# EAGLE schematic tx_no_transistor (EAGLE 9.6.1)
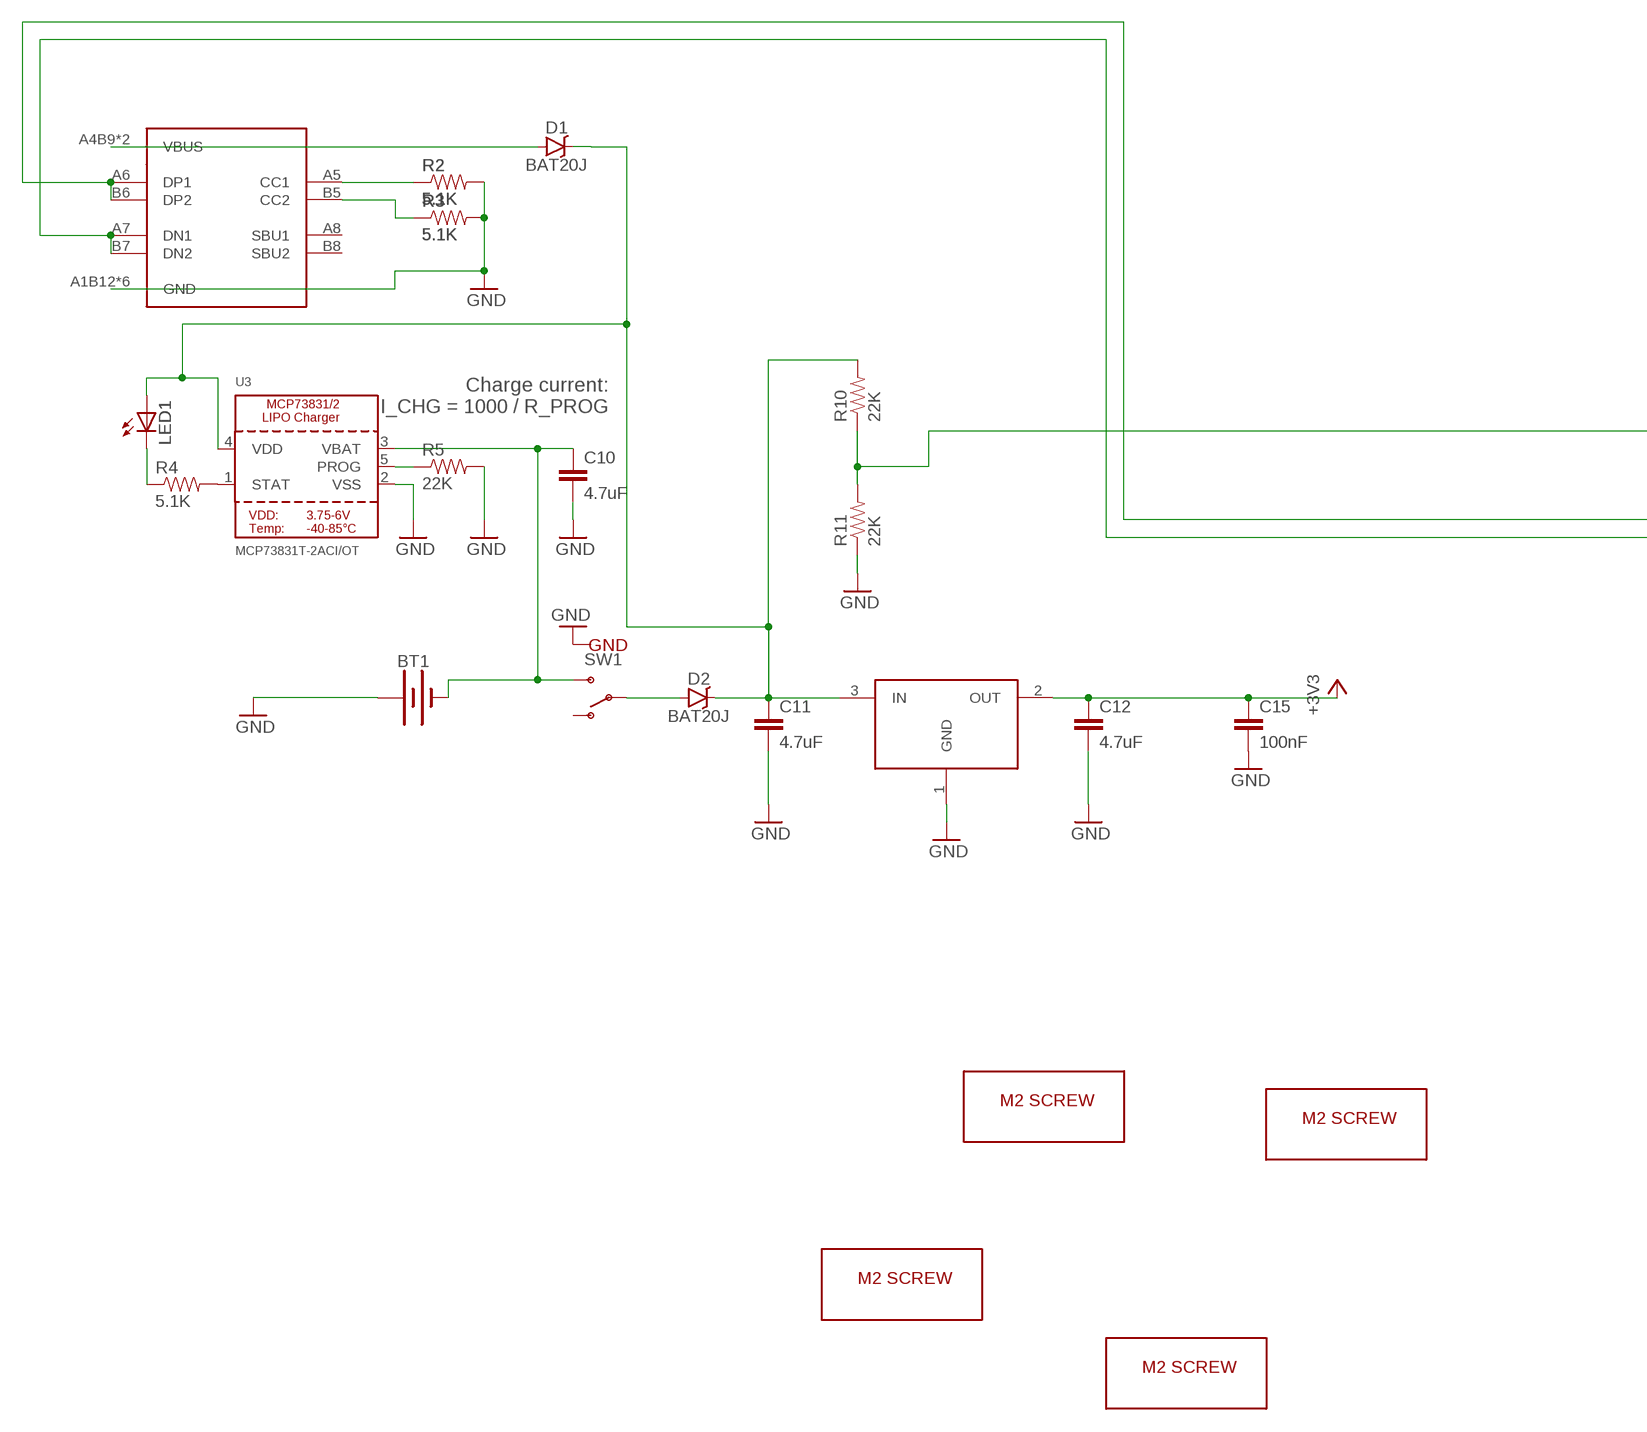
[diagram p0: schematic, sheet 1, part 1 of 2]
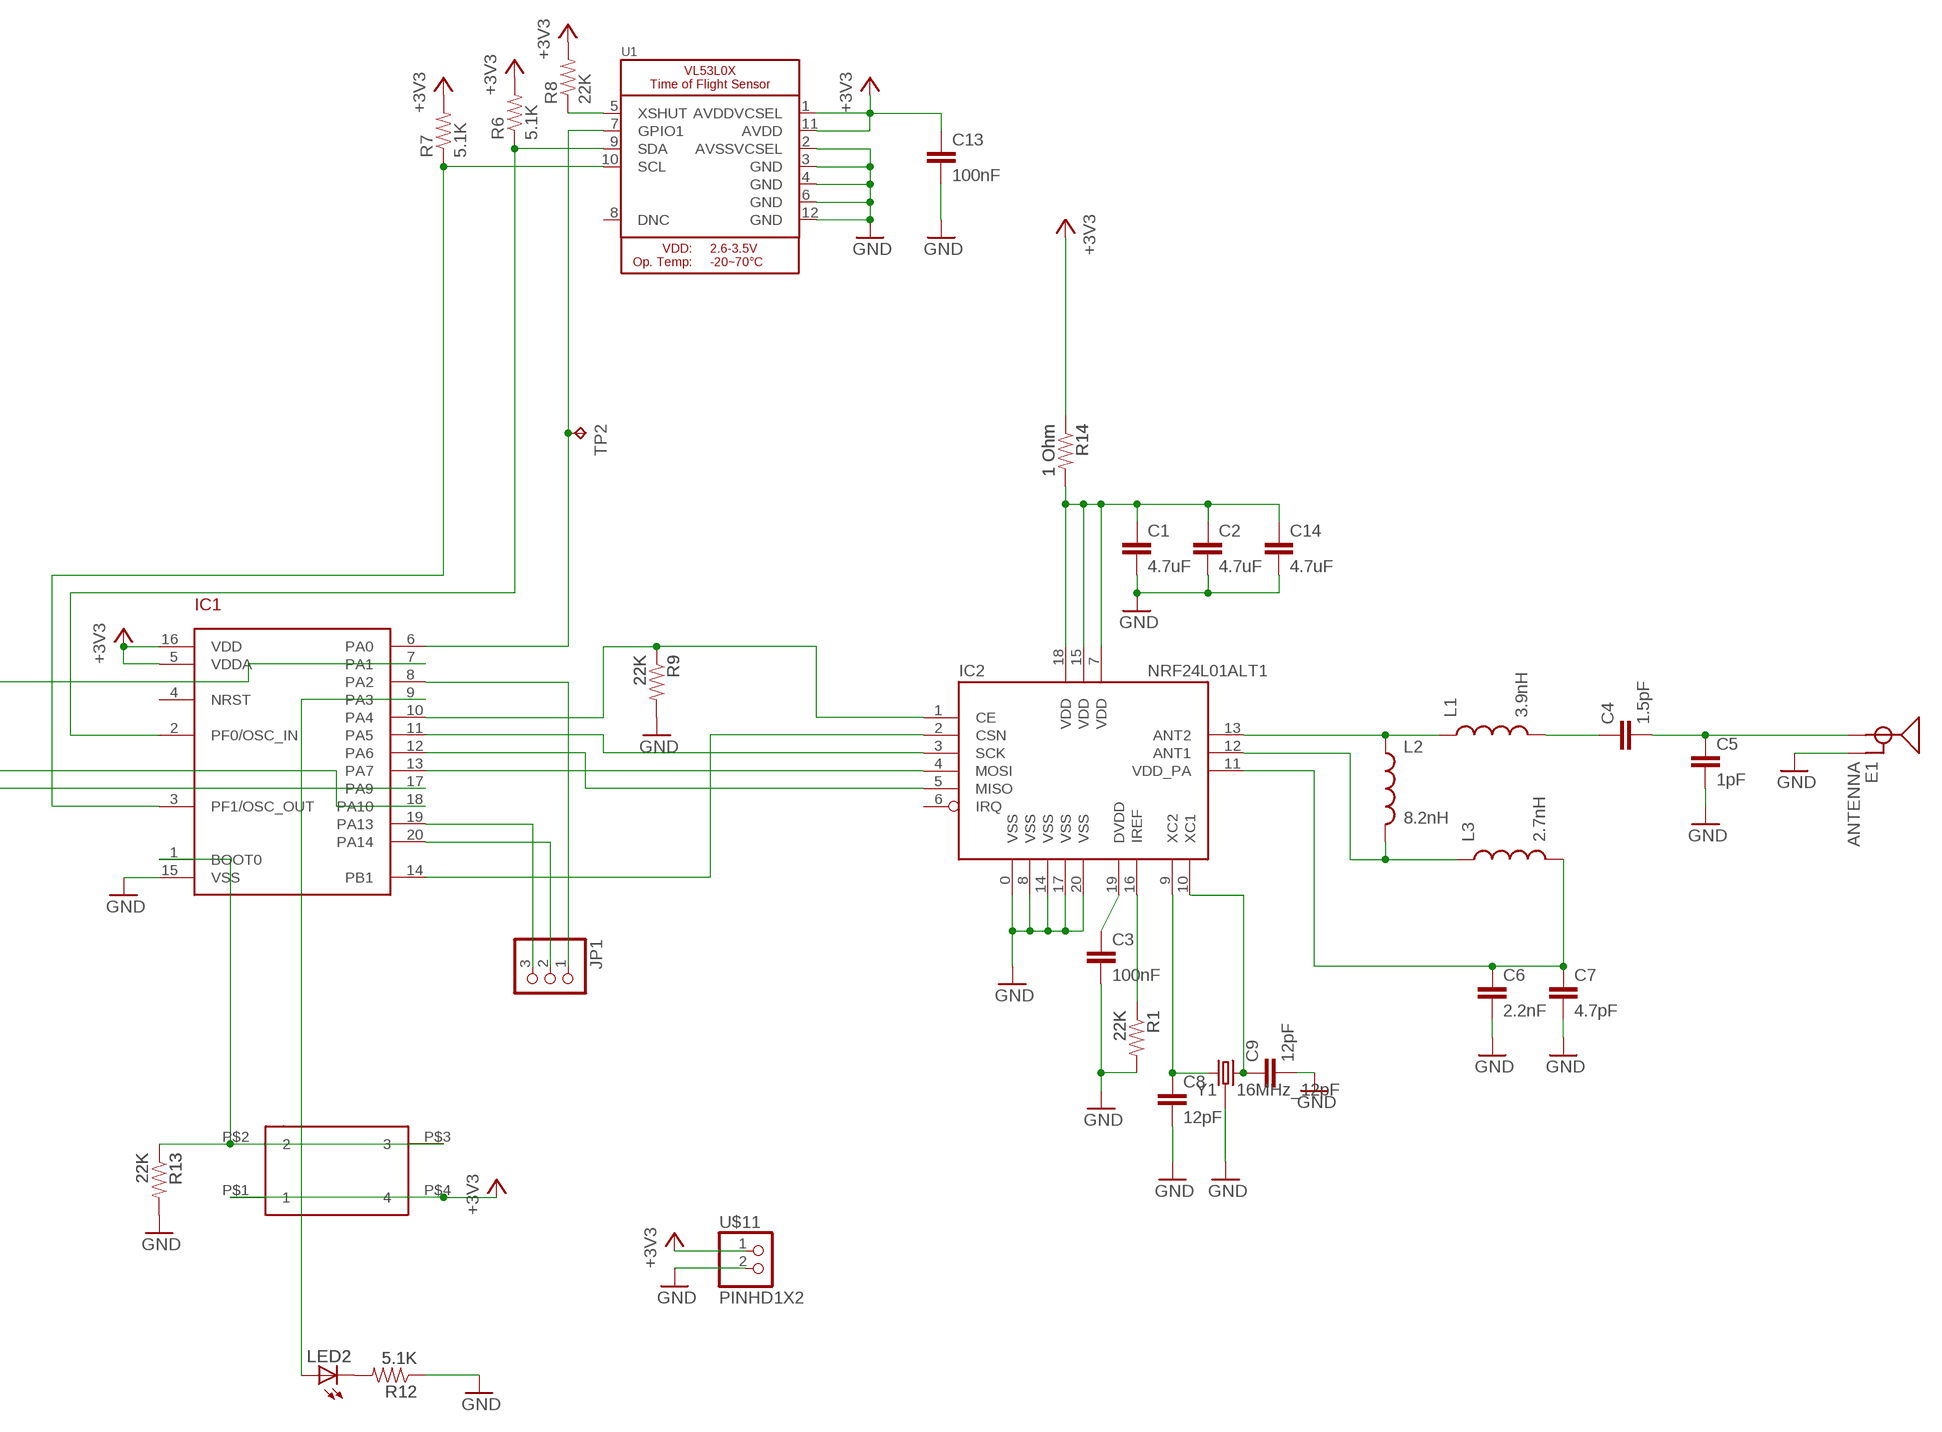
[diagram p1: schematic, sheet 1, part 2 of 2]

## Parts
BT1  TX_SPARKFUN-BATTERIES_BATTERY-24.5MM_PTH  [TX_SPARKFUN-BATTERIES_BATTCON_24.5MM_PTH]
C1  4.7uF  CAP0805  [0805]
C2  4.7uF  CAP0805  [0805]
C3  100nF  CAP0805  [0805]
C4  1.5pF  CAP0805  [0805]
C5  1pF  CAP0805  [0805]
C6  2.2nF  CAP0805  [0805]
C7  4.7pF  CAP0805  [0805]
C8  12pF  CAP0805  [0805]
C9  12pF  CAP0805  [0805]
C10  4.7uF  CAP0805  [0805]
C11  4.7uF  CAP0805  [0805]
C12  4.7uF  CAP0805  [0805]
C13  100nF  CAP0805  [0805]
C14  4.7uF  CAP0805  [0805]
C15  100nF  CAP0805  [0805]
D1  BAT20J  DIODE-SCHOTTKY-BAT20J  [SOD-323]
D2  BAT20J  DIODE-SCHOTTKY-BAT20J  [SOD-323]
E1  ANTENNA  ANTENNATRACE-TUNED  [TRACE_ANTENNA_2.4GHZ_25.7MM_TUNED]
IC1  STM32F030F4  [TSSOP20]
IC2  NRF24L01ALT1  [QFN20_ALT1]
JP1  PINHD-1X3CB  [1X03-CLEANBIG]
L1  3.9nH  INDUCTOR0805  [0805]
L2  8.2nH  INDUCTOR0805  [0805]
L3  2.7nH  INDUCTOR0805  [0805]
LED1  LEDCHIP-LED0805  [CHIP-LED0805]
LED2  LEDCHIP-LED0805  [CHIP-LED0805]
R1  22K  RESISTOR0805-RES  [0805]
R2  5.1K  RESISTOR0805-RES  [0805]
R3  5.1K  RESISTOR0805-RES  [0805]
R4  5.1K  RESISTOR0805-RES  [0805]
R5  22K  RESISTOR0805-RES  [0805]
R6  5.1K  RESISTOR0805-RES  [0805]
R7  5.1K  RESISTOR0805-RES  [0805]
R8  22K  RESISTOR0805-RES  [0805]
R9  22K  RESISTOR0805-RES  [0805]
R10  22K  RESISTOR0805-RES  [0805]
R11  22K  RESISTOR0805-RES  [0805]
R12  5.1K  RESISTOR0805-RES  [0805]
R13  22K  RESISTOR0805-RES  [0805]
R14  1 Ohm  RESISTOR0805-RES  [0805]
SW1  SWITCH-SPDTTDFGDFG  [SWITCH-SPST-SMD-A]
SW2  324_SW324_SWITCH_FOOT_HOLE  [342_SWICH_FOOT_HOLE]
TP2  TPTP10R  [TP10R]
U1  VL53L0X  [LGA12_ST]
U2  USBC_16P  [USBC_16P_FOOT]
U3  MCP73831T-2ACI/OT  MCP73831/2  [SOT23-5]
U4  XC6206_DEV  [SOT23R_INFINEON]
U$1  M2_SCREW_DEV  [M2_SCREW_FOOT]
U$11  PINHD1X2  [1X02]
U$12  M2_SCREW_DEV  [M2_SCREW_FOOT]
U$13  M2_SCREW_DEV  [M2_SCREW_FOOT]
U$14  M2_SCREW_DEV  [M2_SCREW_FOOT]
Y1  16MHz_12pF  CRYSTAL-26MHZSMD-3.2X2.5  [CRYSTAL-SMD-3.2X2.5MM]

## Nets
+3V3: C12.1 C13.1 C15.1 IC1.5(VDDA) IC1.16(VDD) R6.2 R7.2 R8.2 R14.1 SW2.P$1 SW2.P$4 U1.1(AVDDVCSEL) U1.11(AVDD) U4.2(OUT) U$11.1
GND: BT1.2(+) C1.2 C2.2 C3.2 C5.2 C6.2 C7.2 C8.2 C9.2 C10.2 C11.2 C12.2 C13.2 C14.2 C15.2 E1.GND E1.GND2(GND) IC1.15(VSS) IC2.0(VSS) IC2.8(VSS) IC2.14(VSS) IC2.17(VSS) IC2.20(VSS) R1.2 R2.2 R3.2 R5.2 R9.2 R11.1 R12.1 R13.2 SW1.G1(GND) SW1.G2(GND) SW1.G3(GND) SW1.G4(GND) U1.2(AVSSVCSEL) U1.3(GND) U1.4(GND) U1.6(GND) U1.12(GND) U2.A1B12(GND) U2.B11A12(GND) U2.P$13(GND) U2.P$14(GND) U2.P$15(GND) U2.P$16(GND) U3.2(VSS) U4.1(GND) U$11.2 Y1.2 Y1.4
N$1: C3.1 IC2.19(DVDD)
N$2: IC2.16(IREF) R1.1
N$3: IC2.13(ANT2) L1.1 L2.1
N$4: C4.1 L1.2
N$5: C4.2 C5.1 E1.ANT(SIGNAL)
N$6: IC2.12(ANT1) L2.2 L3.1
N$7: C8.1 IC2.9(XC2) Y1.1
N$8: C6.1 C7.1 IC2.11(VDD_PA) L3.2
N$9: C9.1 IC2.10(XC1) Y1.3
N$10: R3.1 U2.B5(CC2)
N$11: R2.1 U2.A5(CC1)
N$12: LED1.C R4.1
N$13: R4.2 U3.1(STAT)
N$14: IC1.13(PA7) IC2.4(MOSI)
N$15: IC1.12(PA6) IC2.5(MISO)
N$16: IC1.11(PA5) IC2.3(SCK)
N$17: R5.1 U3.5(PROG)
N$18: IC1.18(PA10) U2.A6(DP1) U2.B6(DP2)
N$19: D2.A SW1.2(P)
N$20: IC1.14(PB1) IC2.2(CSN)
N$21: IC1.10(PA4) IC2.1(CE) R9.1
N$22: IC1.3(PF1/OSC_OUT) R7.1 U1.10(SCL)
N$23: IC1.2(PF0/OSC_IN) R6.1 U1.9(SDA)
N$24: R8.1 U1.5(XSHUT)
N$25: BT1.1(-) C10.1 SW1.3(S) U3.3(VBAT)
N$26: D1.A U2.A4B9(VBUS) U2.B4A9(VBUS)
N$27: C11.1 D1.C D2.C LED1.A R10.2 U3.4(VDD) U4.3(IN)
N$28: LED2.C R12.2
N$29: IC1.9(PA3) LED2.A
N$30: IC1.1(BOOT0) R13.1 SW2.P$2 SW2.P$3
N$31: IC1.19(PA13) JP1.3
N$32: IC1.20(PA14) JP1.2
N$33: IC1.8(PA2) JP1.1
N$34: IC1.17(PA9) U2.A7(DN1) U2.B7(DN2)
N$35: IC1.7(PA1) R10.1 R11.2
N$36: IC1.6(PA0) TP2.TP U1.7(GPIO1)
N$37: C1.1 C2.1 C14.1 IC2.7(VDD) IC2.15(VDD) IC2.18(VDD) R14.2
Unconnected: IC1.4(NRST) IC2.6(IRQ) SW1.1(O) U1.8(DNC) U2.A8(SBU1) U2.B8(SBU2)

## Notes on the sheet
- Charge current:
  I_CHG = 1000 / R_PROG

## Library data of the parts
BT1 = tx:TX_SPARKFUN-BATTERIES_BATTERY: Battery - Single Cell A variety of battery chemistries, sizes, and footprints. Device List: 20MM_PTH - Coin Cell Battery Holder - 20mm (PTH) <https://www.sparkfun.com/products/783> 20MM_PTH_KIT- Coin Cell battery Holder - 20 mm (PTH) <http://www.sparkfun.com/products/783>kit version with special mask 6.8MM_PTH - Coin Cell Battery Holder - 6.8MM(SMD) <https://www.digikey.com/product-detail/en/seiko-instruments/MS621FE-FL11E/728-1057-ND/1889208?WT.srch=1&gclid=CNOQ5a6LzdQCFZS2wAodXCkE0g> 12MM_SMD - Coin Cell Battery Holder - 12mm (SMD) <https://www.sparkfun.com/products/10592> 12MM_PTH - Coin Cell Battery Holder - 12mm (PTH) <https://www.sparkfun.com/products/7948> 20MM_SMD - 20mm Coin Cell Battery Holder (SMD) (2 legs) Used on the Big Time Watch Kit <https://www.sparkfun.com/products/11734> 20MM_SMD_4LEGS - Coin Cell Battery Holder - 20mm (SMD) <https://www.sparkfun.com/products/11892> 20MM_SMD_4LEGS_OVERPASTE - Coin Cell Battery Holder - 20mm (SMD) <https://www.sparkfun.com/products/11892> (Over-paste on the legs) 24.5MM_PTH - Coin Cell Battery Holder - 24.5mm (PTH) <https://www.sparkfun.com/products/8863> 9V - 9V Battery Holder - PC Mount Used on the SparkFun SparkPunk Sound Kit <https://www.sparkfun.com/products/11177> and SparkFun SparkPunk Sequencer Kit <https://www.sparkfun.com/products/12707> 18650 - Battery Holder - 18650 (PTH) <https://www.sparkfun.com/products/13113> AA - Battery Holder - 1xAA (PTH) <https://www.sparkfun.com/products/7949> AAA - Battery Holder - 1xAAA (PTH) <https://www.sparkfun.com/products/12718> AA_KIT - Battery Holder - 1xAA (PTH) <https://www.sparkfun.com/products/7949> Special kit package - pads only have exposed copper on one side of the board. AAA_KIT - Battery Holder - 1xAAA (PTH) <https://www.sparkfun.com/products/12718> Special kit package - pads only have exposed copper on one side of the board.; SF_SKU: PRT-08863
C1-C9 C11-C15 = clock:CAP: Capacitor Standard 0603 ceramic capacitor, and 0.1" leaded capacitor.
C10 = SparkFun-Passives:CAP: Capacitor Standard 0603 ceramic capacitor, and 0.1" leaded capacitor.
D1 D2 = SparkFun-DiscreteSemi:DIODE-SCHOTTKY: Schottky diodes in SFE's production catalog BAT20J 1A 23V 0.62Vf RB751 120mA 40V 0.37Vf PMEG4005EJ 0.5A 40V 0.42Vf MBRA140 1A 40V 0.5Vf B340A 3A 40V SMA; PROD_ID: DIO-11623
E1 = esp32-thing-temp:ANTENNA: Chip antenna Chip antenna with ground or secondary connection. Common with larger metal RF connectors.
IC1 = exixe_pogo:STM32F030F4
IC2 = nRF24L01-Chip-v13:NRF24L01: 2.4GHz Low Power Transceiver This is the very popular, low cost, very low power RF transceiver from Nordic Semiconductor. Simple SPI interface. SKU: COM-00690
JP1 = adafruit_changed:PINHD-1X3: PIN HEADER
L1-L3 = basicBoard:INDUCTOR: Inductors Basic Inductor/Choke - 0603 and 1206. Footprints are not proven and vary greatly between part numbers. INDUCTOR POWER 3.3UH 4.0A SMD 0.197" L x 0.197" W x 0.177" H (5.00mm x 5.00mm x 4.50mm)
LED1 LED2 = joyAnalog:LED: LED OSRAM: - CHIPLED LG R971, LG N971, LY N971, LG Q971, LY Q971, LO R971, LY R971 LH N974, LH R974 LS Q976, LO Q976, LY Q976 LO Q996 - Hyper CHIPLED LW Q18S LB Q993, LB Q99A, LB R99A - SideLED LS A670, LO A670, LY A670, LG A670, LP A670 LB A673, LV A673, LT A673, LW A673 LH A674 LY A675 LS A676, LA A676, LO A676, LY A676, LW A676 LS A679, LY A679, LG A679 - Hyper Micro SIDELED® LS Y876, LA Y876, LO Y876, LY Y876 LT Y87S - SmartLED LW L88C, LW L88S LB L89C, LB L89S, LG L890 LS L89K, LO L89K, LY L89K LS L896, LA L896, LO L896, LY L896 - TOPLED LS T670, LO T670, LY T670, LG T670, LP T670 LSG T670, LSP T670, LSY T670, LOP T670, LYG T670 LG T671, LOG T671, LSG T671 LB T673, LV T673, LT T673, LW T673 LH T674 LS T676, LA T676, LO T676, LY T676, LB T676, LH T676, LSB T676, LW T676 LB T67C, LV T67C, LT T67C, LS T67K, LO T67K, LY T67K, LW E67C LS E67B, LA E67B, LO E67B, LY E67B, LB E67C, LV E67C, LT E67C LW T67C LS T679, LY T679, LG T679 LS T770, LO T770, LY T770, LG T770, LP T770 LB T773, LV T773, LT T773, LW T773 LH T774 LS E675, LA E675, LY E675, LS T675 LS T776, LA T776, LO T776, LY T776, LB T776 LHGB T686 LT T68C, LB T68C - Hyper Mini TOPLED® LB M676 - Mini TOPLED Santana® LG M470 LS M47K, LO M47K, LY M47K Source: http://www.osram.convergy.de/
R1-R3 R9 R12-R14 = joyAnalog:RESISTOR: Resistor Basic schematic elements and footprints for 0603, 1206, and PTH resistors.
R4-R8 R10 R11 = SparkFun-Passives:RESISTOR: Resistor Basic schematic elements and footprints for 0603, 1206, and PTH resistors.
SW1 = tx:SWITCH-SPDT: SPDT Switch Simple slide switch, Spark Fun Electronics SKU : COM-00102 DPDT SMT slide switch, AYZ0202, SWCH-08179
SW2 = 3pos_slide_switch:324_SW
TP2 = testpad:TP: Test pad
U1 = Adafruit VL53L0X:VL53L0X: VL53L0X - Laser Time of Flight Sensor (2M range)
U2 = my_usbc_16p:USBC_16P
U3 = microbuilder:MCP73831/2: MCP73831/2 LIPO Charger VDD: 3.75 - 6V Temp -40 - 85°C Programmable Charge Rate: 15-500mA NOTE: STAT is a tri-state logic output on the MCP73831 and an open-drain output on the MCP73832. SOT23-5 with 4.2V output and tri-state logic on STAT = MCP73831T-2ACI/OT
U4 = 3pos_slide_switch:XC6206_DEV
U$1 U$12-U$14 = 3pos_slide_switch:M2_SCREW_DEV
U$11 = adafruit_changed:PINHD1X2
Y1 = SparkFun-Clocks:CRYSTAL-26MHZ: 26MHz Crystal w/ Ground Pin Digikey Example <http://www.digikey.com/product-detail/en/epson/TSX-3225%2026.0000MF09Z-AC3/SER3627CT-ND/1802878> Frequency: 26MHz Frequency Stability: ±9ppm Frequency Tolerance: ±10ppm Load Capacitance: 9pF SparkFun Products: SparkFun ESP32 Thing <https://www.sparkfun.com/products/13907> SparkFun ESP8266 Thing Dev Board <https://www.sparkfun.com/products/13711>; PROD_ID: XTAL-12454